# EasyEDA Pro project ESP32_wroom_C.eprj, board PCB1
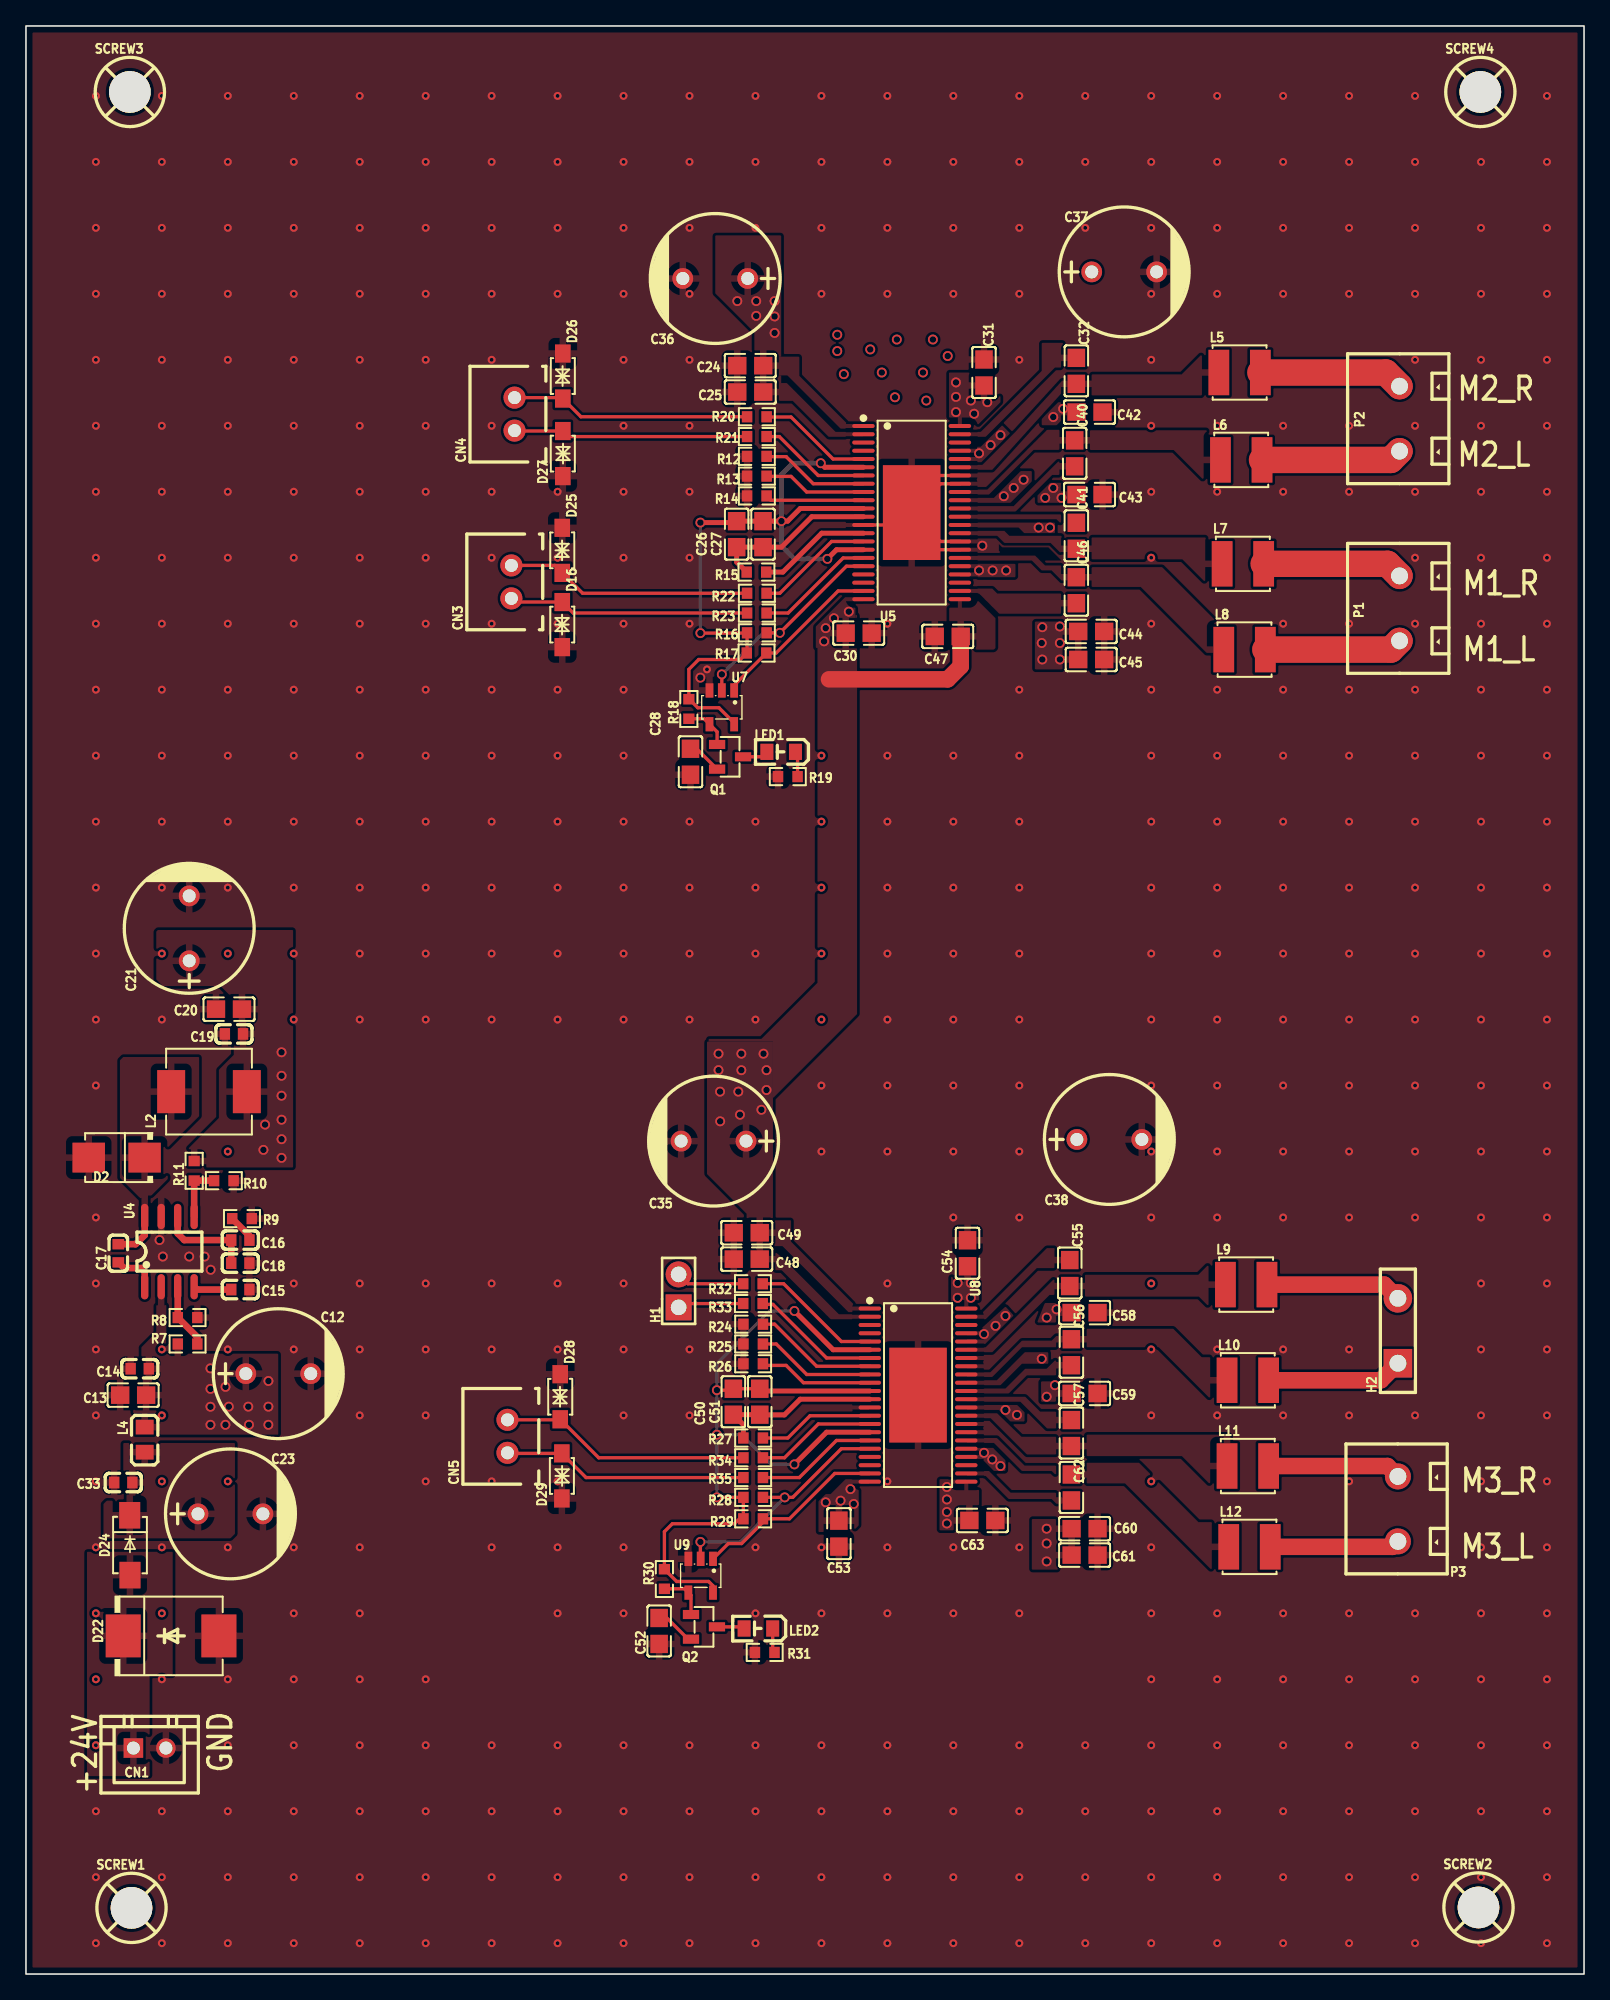
[diagram p1: board, top side]
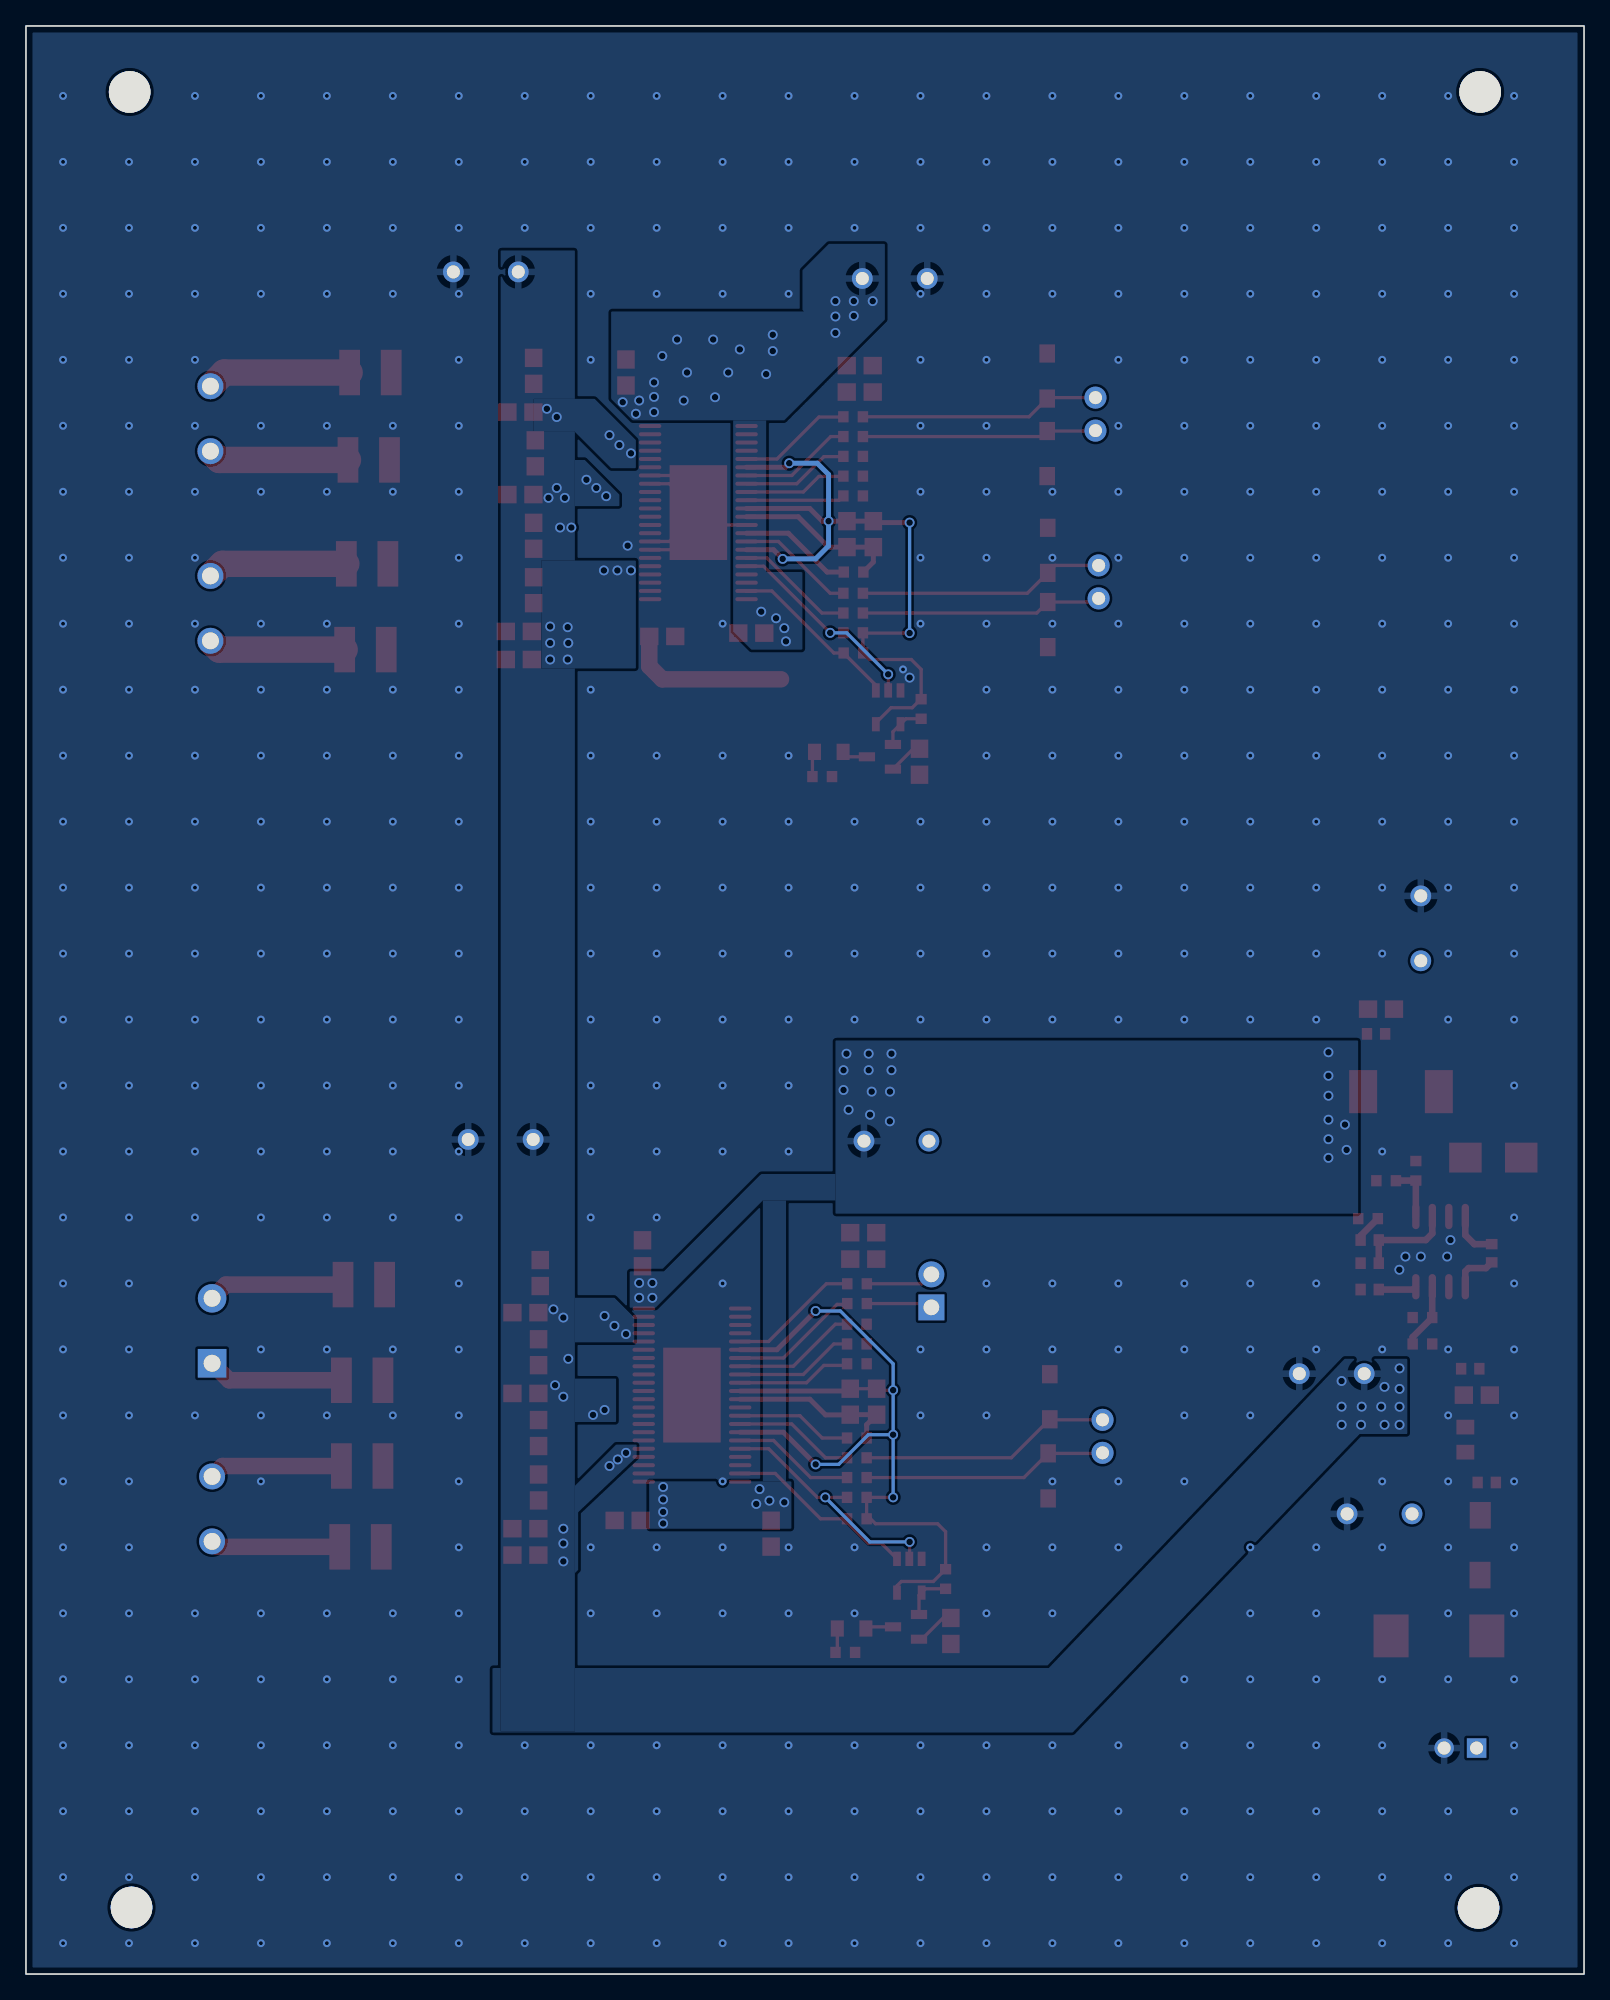
[diagram p2: board, bottom side, seen from below]

Outline 120 x 150 mm; copper layers: Top Layer, Bottom Layer. Coordinates in mm from the lower left corner of the outline.
Outline path: rectangle 0,150 120,0
Stack: Top Layer 0.035mm / Dielectric1 1.51mm FR4 er 4.5 / Bottom Layer 0.035mm

## Design rules (mm)
template: 自定义配置
spacing copperThickness1oz (default): track to track 0.102, other pairs 0.152 to 0.3
spacing copperThickness2oz: track to track 0.203, other pairs 0.152 to 0.508
track width copperThickness1oz (default): min 0.127, default 0.254, max 2.54
track width copperThickness2oz: min 0.203, default 0.254, max 2.54
differential pair differentialPair (default): width min 0.127, default 0.254, max 2.54; gap min 0.152, default 0.152
via viaSize (default): diameter min 0.5, default 0.61, max 10; hole min 0.3, default 0.305, max 6.299

## Placement (name value [footprint] x y rotation side)
C12  470uF  [CAP-TH_BD10.0-P5.00-D0.6-FD-A]  19.43 46.23 0 top
C13  10uF  [C0805]  8.25 44.58 0 top
C14  100nF  [C0603]  8.76 46.61 0 top
C15  10nF  [C0603]  16.51 52.71 180 top
C16  1nF  [C0603]  16.51 56.52 180 top
C17  100nF  [C0603]  7.11 55.5 90 top
C18  100pF  [C0603]  16.51 54.74 180 top
C19  100nF  [C0603]  16.02 72.39 0 top
C20  10uF  [C0805]  15.64 74.29 0 top
C21  470uF  [CAP-TH_BD10.0-P5.00-D0.6-FD-A]  12.57 80.52 90 top
C23  470uF  [CAP-TH_BD10.0-P5.00-D0.6-FD-A]  15.75 35.43 0 top
C24  1uF  [C0805]  55.78 123.85 180 top
C25  1uF  [C0805]  55.78 121.81 180 top
C26  1uF  [C0805]  54.74 110.87 90 top
C27  100nF  [C0805]  56.77 110.87 90 top
C28  100nF  [C0805]  51.18 93.34 270 top
C30  1uF  [C0805]  64.13 103.25 180 top
C31  1uF  [C0805]  73.79 123.32 90 top
C32  100nF  [C0805]  80.9 123.44 90 top
C33  100nF  [C0603]  7.49 37.85 0 top
C35  470uF /50V  [CAP-TH_BD10.0-P5.00-D0.6-FD-A]  52.96 64.14 180 top
C36  470uF /50V  [CAP-TH_BD10.0-P5.00-D0.6-FD-A]  53.09 130.56 180 top
C37  470uF /50V  [CAP-TH_BD10.0-P5.00-D0.6-FD-A]  84.58 131.06 0 top
C38  470uF /50V  [CAP-TH_BD10.0-P5.00-D0.6-FD-A]  83.44 64.26 0 top
C40  100nF  [C0805]  80.77 117.09 270 top
C41  100nF  [C0805]  80.9 110.74 90 top
C42  100nF  [C0805]  81.91 120.27 180 top
C43  100nF  [C0805]  81.91 113.92 180 top
C44  100nF  [C0805]  82.04 103.38 0 top
C45  100nF  [C0805]  82.04 101.22 0 top
C46  100nF  [C0805]  80.9 106.55 270 top
C47  1uF  [C0805]  70.99 103 180 top
C48  1uF  [C0805]  55.51 55.05 180 top
C49  1uF  [C0805]  55.51 57.08 180 top
C50  1uF  [C0805]  54.48 44.07 90 top
C51  100nF  [C0805]  56.52 44.07 90 top
C52  100nF  [C0805]  48.77 26.42 270 top
C53  1uF  [C0805]  62.61 33.91 90 top
C54  1uF  [C0805]  72.52 55.5 90 top
C55  100nF  [C0805]  80.39 53.97 90 top
C56  100nF  [C0805]  80.52 47.88 270 top
C57  100nF  [C0805]  80.52 41.66 90 top
C58  100nF  [C0805]  81.53 50.93 180 top
C59  100nF  [C0805]  81.53 44.7 180 top
C60  100nF  [C0805]  81.53 34.29 0 top
C61  100nF  [C0805]  81.53 32.26 0 top
C62  100nF  [C0805]  80.52 37.47 270 top
C63  1uF  [C0805]  73.66 34.93 0 top
CN1  HX-XH2.54-2PZZ  [CONN-TH_2P-P2.50_HX-2.54MM-2P-ZZ-MS]  9.53 17.4 0 top
CN3  B2B-XH-A(LF)(SN)  [CONN-TH_B2B-XH-A-LF-SN]  37.38 107.19 90 top
CN4  B2B-XH-A(LF)(SN)  [CONN-TH_B2B-XH-A-LF-SN]  37.63 120.11 90 top
CN5  B2B-XH-A(LF)(SN)  [CONN-TH_B2B-XH-A-LF-SN]  37.08 41.4 90 top
D2  SS1060B  [SMB_L4.3-W3.6-LS5.3-RD]  6.98 62.87 180 top
D16  SMF24CA  [SOD-123FL_L2.7-W1.8-LS3.8-BI]  41.31 103.91 270 top
D22  SMCJ24A  [SMC_L6.9-W5.9-LS7.9-RD]  11.18 26.03 0 top
D24  SS54  [SMA_L4.3-W2.6-LS5.0-FD]  8 33.02 90 top
D25  SMF24CA  [SOD-123FL_L2.7-W1.8-LS3.8-BI]  41.31 109.62 270 top
D26  SMF24CA  [SOD-123FL_L2.7-W1.8-LS3.8-BI]  41.35 123.04 270 top
D27  SMF24CA  [SOD-123FL_L2.7-W1.8-LS3.8-BI]  41.35 117.08 90 top
D28  SMF24CA  [SOD-123FL_L2.7-W1.8-LS3.8-BI]  41.15 44.45 270 top
D29  SMF24CA  [SOD-123FL_L2.7-W1.8-LS3.8-BI]  41.28 38.35 90 top
H1  PZ254V-11-02P  [HDR-TH_2P-P2.54-V-M]  50.27 52.6 90 top
H2  971-SLR-THR-1.3/02  [HDR-TH_2P-P5.00-V-M]  105.66 49.53 90 top
L2  10uH  [IND-SMD_L7.1-W6.6]  14.1 67.95 0 top
L4  GZ2012D101TF  [L0805]  9.14 41.15 90 top
L5  4.7uH  [IND-SMD_L4.0-W4.0]  93.47 123.32 0 top
L6  4.7uH  [IND-SMD_L4.0-W4.0]  93.6 116.59 0 top
L7  4.7uH  [IND-SMD_L4.0-W4.0]  93.73 108.59 0 top
L8  4.7uH  [IND-SMD_L4.0-W4.0]  93.85 101.98 0 top
L9  4.7uH  [IND-SMD_L4.0-W4.0]  93.98 53.09 0 top
L10  4.7uH  [IND-SMD_L4.0-W4.0]  94.11 45.72 0 top
L11  4.7uH  [IND-SMD_L4.0-W4.0]  94.11 39.12 0 top
L12  4.7uH  [IND-SMD_L4.0-W4.0]  94.23 32.89 0 top
LED1  XL-2012SURC  [LED0805-RD_RED]  58.17 94.11 180 top
LED2  XL-2012SURC  [LED0805-RD_RED]  56.41 26.61 180 top
P1  WJ126V-5.0-2P  [CONN-TH_WJ126V-5.0-2P]  105.79 105.16 180 top
P2  WJ126V-5.0-2P  [CONN-TH_WJ126V-5.0-2P]  105.79 119.76 180 top
P3  WJ126V-5.0-2P  [CONN-TH_WJ126V-5.0-2P]  105.66 35.81 180 top
Q1  SI2305CDS-T1-GE3  [SOT-23-3_L2.9-W1.3-P1.90-LS2.4-BR]  54.23 93.73 180 top
Q2  SI2305CDS-T1-GE3  [SOT-23-3_L2.9-W1.3-P1.90-LS2.4-BR]  52.22 26.73 180 top
R7  12kΩ  [R0603]  12.45 48.51 180 top
R8  2.7kΩ  [R0603]  12.45 50.55 180 top
R9  22kΩ  [R0603]  16.64 58.17 180 top
R10  2kΩ  [R0603]  15.24 61.09 180 top
R11  27kΩ  [R0603]  12.95 61.85 90 top
R12  10kΩ  [R0603]  56.29 116.86 180 top
R13  10kΩ  [R0603]  56.29 115.34 180 top
R14  10kΩ  [R0603]  56.29 113.81 180 top
R15  82kΩ  [R0603]  56.26 107.95 180 top
R16  4.7kΩ  [R0603]  56.29 103.27 180 top
R17  4.7kΩ  [R0603]  56.27 101.72 180 top
R18  4.7kΩ  [R0603]  51.05 97.41 90 top
R19  1kΩ  [R0603]  58.67 92.2 0 top
R20  22Ω  [R0603]  56.29 119.91 180 top
R21  22Ω  [R0603]  56.29 118.39 180 top
R22  22Ω  [R0603]  56.29 106.32 180 top
R23  22Ω  [R0603]  56.29 104.8 180 top
R24  10kΩ  [R0603]  56.01 50.04 180 top
R25  10kΩ  [R0603]  56.01 48.51 180 top
R26  10kΩ  [R0603]  56.01 46.99 180 top
R27  82kΩ  [R0603]  56.01 41.28 180 top
R28  4.7kΩ  [R0603]  56.01 36.7 180 top
R29  4.7kΩ  [R0603]  56.01 35.05 180 top
R30  4.7kΩ  [R0603]  49.17 30.42 90 top
R31  1kΩ  [R0603]  56.9 24.77 0 top
R32  22Ω  [R0603]  55.99 53.15 180 top
R33  22Ω  [R0603]  55.99 51.63 180 top
R34  22Ω  [R0603]  56.01 39.75 180 top
R35  22Ω  [R0603]  56.01 38.23 180 top
SCREW1  -  [M3螺丝]  8.13 5.09 0 top
SCREW2  -  [M3螺丝]  111.87 5.12 0 top
SCREW3  -  [M3螺丝]  8 144.92 0 top
SCREW4  -  [M3螺丝]  112.01 144.92 0 top
U4  TPS54331DR  [SOIC-8_L5.0-W4.0-P1.27-LS6.0-BL]  11.05 55.63 0 top
U5  DRV8412DDWR  [HTSSOP-44_L14.0-W6.1-P0.64-LS8.1-BL-EP]  68.22 112.53 270 top
U7  SN74AHC1G08DBVR  [SOT-23-5_L3.0-W1.7-P0.95-LS2.8-BR]  53.59 97.54 90 top
U8  DRV8412DDWR  [HTSSOP-44_L14.0-W6.1-P0.64-LS8.1-BL-EP]  68.71 44.58 270 top
U9  SN74AHC1G08DBVR  [SOT-23-5_L3.0-W1.7-P0.95-LS2.8-BR]  51.97 30.67 90 top

## Footprints (pads in the part's own frame, mm; a bottom-side part is the same pattern mirrored in y, then rotated)
C0603
  rect 0.8x0.9 smd: 1(-0.7,0) 2(0.7,0)
C0805
  rect 1.41x1.35 smd: 1(-1,0) 2(1,0)
CAP-TH_BD10.0-P5.00-D0.6-FD-A
  round 1.6 hole 1: 1(-2.5,0) 2(2.5,0)
CONN-TH_2P-P2.50_HX-2.54MM-2P-ZZ-MS
  rect 1.5x1.5 hole 1: 1(-1.25,0)
  round 1.5 hole 1: 2(1.25,0)
CONN-TH_B2B-XH-A-LF-SN
  round 1.7 hole 1: 1(1.27,0) 2(-1.27,0)
CONN-TH_WJ126V-5.0-2P
  round 2 hole 1.3: 1(0,2.501) 2(0,-2.501)
HDR-TH_2P-P2.54-V-M
  rect 2x2 hole 1.2: 1(-1.27,0)
  round 2 hole 1.2: 2(1.27,0)
HDR-TH_2P-P5.00-V-M
  rect 2.2x2.2 hole 1.3: 1(-2.5,0)
  round 2.2 hole 1.3: 2(2.5,0)
HTSSOP-44_L14.0-W6.1-P0.64-LS8.1-BL-EP
  oval 0.308x1.729 smd: 1(-6.668,-3.715) 2(-6.032,-3.715) 3(-5.397,-3.715) 4(-4.763,-3.715) 5(-4.128,-3.715) 6(-3.493,-3.715) 7(-2.857,-3.715) 8(-2.223,-3.715) 9(-1.587,-3.715) 10(-0.953,-3.715) 11(-0.318,-3.715) 12(0.318,-3.715) 13(0.953,-3.715) 14(1.587,-3.715) 15(2.223,-3.715) 16(2.857,-3.715) 17(3.493,-3.715) 18(4.128,-3.715) 19(4.763,-3.715) 20(5.397,-3.715) 21(6.032,-3.715) 22(6.668,-3.715) 23(6.668,3.715) 24(6.032,3.715) 25(5.397,3.715) 26(4.763,3.715) 27(4.128,3.715) 28(3.493,3.715) 29(2.857,3.715) 30(2.223,3.715) 31(1.587,3.715) 32(0.953,3.715) 33(0.318,3.715) 34(-0.318,3.715) 35(-0.953,3.715) 36(-1.587,3.715) 37(-2.223,3.715) 38(-2.857,3.715) 39(-3.493,3.715) 40(-4.128,3.715) 41(-4.763,3.715) 42(-5.397,3.715) 43(-6.032,3.715) 44(-6.668,3.715)
  rect 7.3x4.43 smd: 45(0,0)
IND-SMD_L4.0-W4.0
  rect 1.6x3.5 smd: 1(-1.6,0) 2(1.6,0)
IND-SMD_L7.1-W6.6
  rect 2.15x3.32 smd: 1(-2.913,0) 2(2.913,0)
L0805
  rect 1.133x1.377 smd: 1(-0.966,0) 2(0.966,0)
LED0805-RD_RED
  rect 1x1.25 smd: 1(-1.1,0) 2(1.1,0)
M3螺丝
  round 3.2 hole 3.2: 1(0,0)
R0603
  rect 0.806x0.864 smd: 1(-0.753,0) 2(0.753,0)
SMA_L4.3-W2.6-LS5.0-FD
  rect 2.046x1.62 smd: 1(-2.304,-0.009) 2(2.304,0.009)
SMB_L4.3-W3.6-LS5.3-RD
  rect 2.5x2.3 smd: 1(-2.15,0) 2(2.15,0)
SMC_L6.9-W5.9-LS7.9-RD
  rect 2.7x3.3 smd: 1(-3.687,0) 2(3.687,0)
SOD-123FL_L2.7-W1.8-LS3.8-BI
  rect 1.4x1.2 smd: 1(-1.735,0) 2(1.735,0)
SOIC-8_L5.0-W4.0-P1.27-LS6.0-BL
  oval 0.569x1.95 smd: 1(-1.905,-2.705) 2(-0.635,-2.705) 3(0.635,-2.705) 4(1.905,-2.705) 5(1.905,2.705) 6(0.635,2.705) 7(-0.635,2.705) 8(-1.905,2.705)
SOT-23-3_L2.9-W1.3-P1.90-LS2.4-BR
  rect 1.25x0.7 smd: 1(1,-0.95) 2(1,0.95) 3(-1,0)
SOT-23-5_L3.0-W1.7-P0.95-LS2.8-BR
  rect 1.1x0.6 smd: 1(1.3,-0.95) 2(1.3,0) 3(1.3,0.95) 4(-1.3,0.95) 5(-1.3,-0.95)

## Nets
As in the schematic.

Pads without a net: SCREW1 1; SCREW2 1; SCREW3 1; SCREW4 1; U5 3 4 19 20 25 42; U8 3 4 19 20 25 42

## Via types
v1: diameter 0.762, hole 0.508, Top Layer to Bottom Layer, 130 vias
v2: diameter 0.61, hole 0.305, Top Layer to Bottom Layer, 515 vias

## Routing (per net, layer and track width the routed paths; a pad name or vN(x,y) marks a point on that pad's centre or on a via; arc(x,y) is an arc through that point)
+12V: length 12.9
  Top Layer w1.27: 61.85,99.7 70.99,99.7 71.99,100.7 C47.1
  vias: v1(18.29,63.46) v1(18.42,65.41) v1(19.69,70.98) v1(19.69,69.17) v1(19.69,67.63) v1(19.69,65.78) v1(19.69,64.28) v1(19.69,62.84) v1(53.34,70.87) v1(53.34,69.6) v1(53.46,67.95) v1(53.47,65.66) v1(54.79,128.82) v1(54.86,67.95) v1(54.99,66.17) v1(55.1,70.87) v1(55.1,69.6) v1(56.24,128.82) v1(56.24,127.68) v1(56.64,66.55) v1(56.81,70.87) v1(57.03,69.6) v1(57.03,68.07) v1(57.66,128.82) v1(57.66,127.63) v1(57.66,126.37) v1(61.47,102.62) v1(61.59,103.63) v1(61.59,36.32) v1(62.23,104.39) v1(62.48,126.22) v1(62.48,124.97) v1(62.74,36.45) v1(62.99,123.19) v1(63.37,104.9) v1(63.5,37.34) v1(63.75,36.19) v1(65.02,125.09) v1(65.91,123.32) v1(66.93,121.41) v1(67.07,125.86) v1(69.09,123.32) v1(69.34,121.16) v1(69.85,125.86) v1(70.93,37.5) v1(70.93,36.54) v1(70.93,35.58) v1(70.93,34.69) v1(70.99,124.59) v1(71.63,122.56) v1(71.63,121.44) v1(71.63,120.27) v1(71.75,53.21) v1(71.75,52.07) v1(72.77,121.16) v1(72.77,53.21) v1(72.77,52.07) v1(73.03,120.14) v1(74.04,121.03)
AGND_C1: length 13
  Top Layer w0.381: U5.12 60.52,112.21 58.18,109.87 C27.1 C26.1 54.74,108.72 R15.2
AGND_C2: length 13.1
  Top Layer w0.381: R27.2 55.25,42.3 C50.1 C51.1 56.53,43.05 58.42,43.05 59.63,44.26 U8.12
GND: length 23.8
  Top Layer w0.254: 70.44,110.31 69.41,110.31 68.78,109.67 U5.29 ; 70.44,110.31 U5.30 ; 70.44,110.31 U5.45 ; U5.13 67.26,111.58 U5.45 ; U5.37 70.44,114.75 ; 70.44,114.75 69.27,114.75 68.64,115.39 U5.38 ; 70.44,114.75 U5.45
  vias: v1(10.29,56.52) v1(10.54,55.25) v1(12.57,55.25) v1(13.76,55.25) v1(14.22,54.23) v1(51.94,99.82) v1(73.66,109.98) v2(5.39,144.62) v2(5.39,139.53) v2(5.39,134.46) v2(5.39,129.38) v2(5.39,124.3) v2(5.39,119.22) v2(5.39,114.14) v2(5.39,109.06) v2(5.39,103.98) v2(5.39,98.9) v2(5.39,93.81) v2(5.39,88.73) v2(5.39,83.66) v2(5.39,78.58) v2(5.39,73.5) v2(5.39,68.42) v2(5.39,58.26) v2(5.39,53.18) v2(5.39,48.09) v2(5.39,43.02) v2(5.39,37.94) v2(5.39,32.86) v2(5.39,27.78) v2(5.39,22.69) v2(5.39,17.62) v2(5.39,12.53) v2(5.39,7.46) v2(5.39,2.38) v2(10.47,144.62) v2(10.47,139.53) v2(10.47,134.46) v2(10.47,129.38) v2(10.47,124.3) v2(10.47,119.22) v2(10.47,114.14) v2(10.47,109.06) v2(10.47,103.98) v2(10.47,98.9) v2(10.47,93.81) v2(10.47,88.73) v2(10.47,83.66) v2(10.47,78.58) v2(10.47,73.5) v2(10.47,48.09) v2(10.47,43.02) v2(10.47,37.94) v2(10.47,32.86) v2(10.47,27.78) v2(10.47,22.69) v2(10.47,12.53) v2(10.47,7.46) v2(10.47,2.38) v2(15.55,144.62) v2(15.55,139.53) v2(15.55,134.46) v2(15.55,129.38) v2(15.55,124.3) v2(15.55,119.22) v2(15.55,114.14) v2(15.55,109.06) v2(15.55,103.98) v2(15.55,98.9) v2(15.55,93.81) v2(15.55,88.73) v2(15.55,83.66) v2(15.55,78.58) v2(15.55,63.34) v2(15.55,48.09) v2(15.55,37.94) v2(15.55,32.86) v2(15.55,22.69) v2(15.55,17.62) v2(15.55,12.53) v2(15.55,7.46) v2(15.55,2.38) v2(20.62,144.62) v2(20.62,139.53) v2(20.62,134.46) v2(20.62,129.38) v2(20.62,124.3) v2(20.62,119.22) v2(20.62,114.14) v2(20.62,109.06) v2(20.62,103.98) v2(20.62,98.9) v2(20.62,93.81) v2(20.62,88.73) v2(20.62,83.66) v2(20.62,78.58) v2(20.62,73.5) v2(20.62,53.18) v2(20.62,48.09) v2(20.62,32.86) v2(20.62,27.78) v2(20.62,22.69) v2(20.62,17.62) v2(20.62,12.53) v2(20.62,7.46) v2(20.62,2.38) v2(25.7,144.62) v2(25.7,139.53) v2(25.7,134.46) v2(25.7,129.38) v2(25.7,124.3) v2(25.7,119.22) v2(25.7,114.14) v2(25.7,109.06) v2(25.7,103.98) v2(25.7,98.9) v2(25.7,93.81) v2(25.7,88.73) v2(25.7,83.66) v2(25.7,78.58) v2(25.7,73.5) v2(25.7,53.18) v2(25.7,48.09) v2(25.7,43.02) v2(25.7,32.86) v2(25.7,27.78) v2(25.7,22.69) v2(25.7,17.62) v2(25.7,12.53) v2(25.7,7.46) v2(25.7,2.38) v2(30.78,144.62) v2(30.78,139.53) v2(30.78,134.46) v2(30.78,129.38) v2(30.78,124.3) v2(30.78,119.22) v2(30.78,114.14) v2(30.78,109.06) v2(30.78,103.98) v2(30.78,98.9) v2(30.78,93.81) v2(30.78,88.73) v2(30.78,83.66) v2(30.78,78.58) v2(30.78,73.5) v2(30.78,53.18) v2(30.78,48.09) v2(30.78,43.02) v2(30.78,37.94) v2(30.78,22.69) v2(30.78,17.62) v2(30.78,12.53) v2(30.78,7.46) v2(30.78,2.38) v2(35.86,144.62) v2(35.86,139.53) v2(35.86,134.46) v2(35.86,129.38) v2(35.86,124.3) v2(35.86,119.22) v2(35.86,114.14) v2(35.86,109.06) v2(35.86,103.98) v2(35.86,98.9) v2(35.86,93.81) v2(35.86,88.73) v2(35.86,83.66) v2(35.86,78.58) v2(35.86,73.5) v2(35.86,53.18) v2(35.86,48.09) v2(35.86,37.94) v2(35.86,32.86) v2(35.86,17.62) v2(35.86,12.53) v2(35.86,7.46) v2(35.86,2.38) v2(40.95,144.62) v2(40.95,139.53) v2(40.95,134.46) v2(40.95,129.38) v2(40.95,114.14) v2(40.95,109.06) v2(40.95,103.98) v2(40.95,98.9) v2(40.95,93.81) v2(40.95,88.73) v2(40.95,83.66) v2(40.95,78.58) v2(40.95,73.5) v2(40.95,53.18) v2(40.95,48.09) v2(40.95,37.94) v2(40.95,32.86) v2(40.95,27.78) v2(40.95,17.62) v2(40.95,12.53) v2(40.95,7.46) v2(40.95,2.38) v2(46.03,144.62) v2(46.03,139.53) v2(46.03,134.46) v2(46.03,129.38) v2(46.03,124.3) v2(46.03,119.22) v2(46.03,114.14) v2(46.03,109.06) v2(46.03,103.98) v2(46.03,98.9) v2(46.03,93.81) v2(46.03,88.73) v2(46.03,83.66) v2(46.03,78.58) v2(46.03,73.5) v2(46.03,53.18) v2(46.03,48.09) v2(46.03,43.02) v2(46.03,32.86) v2(46.03,27.78) v2(46.03,17.62) v2(46.03,12.53) v2(46.03,7.46) v2(46.03,2.38) v2(51.1,144.62) v2(51.1,139.53) v2(51.1,134.46) v2(51.1,129.38) v2(51.1,124.3) v2(51.1,119.22) v2(51.1,114.14) v2(51.1,109.06) v2(51.1,103.98) v2(51.1,88.73) v2(51.1,83.66) v2(51.1,78.58) v2(51.1,73.5) v2(51.1,48.09) v2(51.1,43.02) v2(51.1,17.62) v2(51.1,12.53) v2(51.1,7.46) v2(51.1,2.38) v2(52.45,100.46) v2(56.19,144.62) v2(56.19,139.53) v2(56.19,134.46) v2(56.19,88.73) v2(56.19,83.66) v2(56.19,78.58) v2(56.19,73.5) v2(56.19,32.86) v2(56.19,27.78) v2(56.19,17.62) v2(56.19,12.53) v2(56.19,7.46) v2(56.19,2.38) v2(61.27,144.62) v2(61.27,139.53) v2(61.27,134.46) v2(61.27,129.38) v2(61.27,93.81) v2(61.27,88.73) v2(61.27,83.66) v2(61.27,78.58) v2(61.27,73.5) v2(61.27,68.42) v2(61.27,63.34) v2(61.27,32.86) v2(61.27,27.78) v2(61.27,17.62) v2(61.27,12.53) v2(61.27,7.46) v2(61.27,2.38) v2(66.34,144.62) v2(66.34,139.53) v2(66.34,134.46) v2(66.34,129.38) v2(66.34,103.98) v2(66.34,93.81) v2(66.34,88.73) v2(66.34,83.66) v2(66.34,78.58) v2(66.34,73.5) v2(66.34,68.42) v2(66.34,63.34) v2(66.34,53.18) v2(66.34,37.94) v2(66.34,32.86) v2(66.34,27.78) v2(66.34,17.62) v2(66.34,12.53) v2(66.34,7.46) v2(66.34,2.38) v2(71.43,144.62) v2(71.43,139.53) v2(71.43,134.46) v2(71.43,129.38) v2(71.43,93.81) v2(71.43,88.73) v2(71.43,83.66) v2(71.43,78.58) v2(71.43,73.5) v2(71.43,68.42) v2(71.43,63.34) v2(71.43,58.26) v2(71.43,32.86) v2(71.43,27.78) v2(71.43,17.62) v2(71.43,12.53) v2(71.43,7.46) v2(71.43,2.38) v2(76.5,144.62) v2(76.5,139.53) v2(76.5,134.46) v2(76.5,129.38) v2(76.5,124.3) v2(76.5,98.9) v2(76.5,93.81) v2(76.5,88.73) v2(76.5,83.66) v2(76.5,78.58) v2(76.5,73.5) v2(76.5,68.42) v2(76.5,63.34) v2(76.5,58.26) v2(76.5,32.86) v2(76.5,27.78) v2(76.5,17.62) v2(76.5,12.53) v2(76.5,7.46) v2(76.5,2.38) v2(81.59,144.62) v2(81.59,139.53) v2(81.59,134.46) v2(81.59,17.62) v2(81.59,12.53) v2(81.59,7.46) v2(81.59,2.38) v2(86.66,144.62) v2(86.66,139.53) v2(86.66,134.46) v2(86.66,129.38) v2(86.66,124.3) v2(86.66,119.22) v2(86.66,114.14) v2(86.66,109.06) v2(86.66,103.98) v2(86.66,98.9) v2(86.66,93.81) v2(86.66,88.73) v2(86.66,83.66) v2(86.66,78.58) v2(86.66,73.5) v2(86.66,68.42) v2(86.66,63.34) v2(86.66,58.26) v2(86.66,53.18) v2(86.66,48.09) v2(86.66,43.02) v2(86.66,37.94) v2(86.66,32.86) v2(86.66,27.78) v2(86.66,22.69) v2(86.66,17.62) v2(86.66,12.53) v2(86.66,7.46) v2(86.66,2.38) v2(91.75,144.62) v2(91.75,139.53) v2(91.75,134.46) v2(91.75,129.38) v2(91.75,119.22) v2(91.75,114.14) v2(91.75,98.9) v2(91.75,93.81) v2(91.75,88.73) v2(91.75,83.66) v2(91.75,78.58) v2(91.75,73.5) v2(91.75,68.42) v2(91.75,63.34) v2(91.75,58.26) v2(91.75,48.09) v2(91.75,43.02) v2(91.75,27.78) v2(91.75,22.69) v2(91.75,17.62) v2(91.75,12.53) v2(91.75,7.46) v2(91.75,2.38) v2(96.82,144.62) v2(96.82,139.53) v2(96.82,134.46) v2(96.82,129.38) v2(96.82,119.22) v2(96.82,114.14) v2(96.82,103.98) v2(96.82,98.9) v2(96.82,93.81) v2(96.82,88.73) v2(96.82,83.66) v2(96.82,78.58) v2(96.82,73.5) v2(96.82,68.42) v2(96.82,63.34) v2(96.82,58.26) v2(96.82,48.09) v2(96.82,43.02) v2(96.82,27.78) v2(96.82,22.69) v2(96.82,17.62) v2(96.82,12.53) v2(96.82,7.46) v2(96.82,2.38) v2(101.91,144.62) v2(101.91,139.53) v2(101.91,134.46) v2(101.91,129.38) v2(101.91,119.22) v2(101.91,114.14) v2(101.91,103.98) v2(101.91,98.9) v2(101.91,93.81) v2(101.91,88.73) v2(101.91,83.66) v2(101.91,78.58) v2(101.91,73.5) v2(101.91,68.42) v2(101.91,63.34) v2(101.91,58.26) v2(101.91,48.09) v2(101.91,43.02) v2(101.91,37.94) v2(101.91,27.78) v2(101.91,22.69) v2(101.91,17.62) v2(101.91,12.53) v2(101.91,7.46) v2(101.91,2.38) v2(106.99,144.62) v2(106.99,139.53) v2(106.99,134.46) v2(106.99,129.38) v2(106.99,124.3) v2(106.99,119.22) v2(106.99,114.14) v2(106.99,109.06) v2(106.99,103.98) v2(106.99,98.9) v2(106.99,93.81) v2(106.99,88.73) v2(106.99,83.66) v2(106.99,78.58) v2(106.99,73.5) v2(106.99,68.42) v2(106.99,63.34) v2(106.99,58.26) v2(106.99,43.02) v2(106.99,27.78) v2(106.99,22.69) v2(106.99,17.62) v2(106.99,12.53) v2(106.99,7.46) v2(106.99,2.38) v2(112.06,139.53) v2(112.06,134.46) v2(112.06,129.38) v2(112.06,124.3) v2(112.06,119.22) v2(112.06,114.14) v2(112.06,109.06) v2(112.06,103.98) v2(112.06,98.9) v2(112.06,93.81) v2(112.06,88.73) v2(112.06,83.66) v2(112.06,78.58) v2(112.06,73.5) v2(112.06,68.42) v2(112.06,63.34) v2(112.06,58.26) v2(112.06,53.18) v2(112.06,48.09) v2(112.06,43.02) v2(112.06,37.94) v2(112.06,32.86) v2(112.06,27.78) v2(112.06,22.69) v2(112.06,17.62) v2(112.06,12.53) v2(112.06,7.46) v2(112.06,2.38) v2(117.15,144.62) v2(117.15,139.53) v2(117.15,134.46) v2(117.15,129.38) v2(117.15,124.3) v2(117.15,119.22) v2(117.15,114.14) v2(117.15,109.06) v2(117.15,103.98) v2(117.15,98.9) v2(117.15,93.81) v2(117.15,88.73) v2(117.15,83.66) v2(117.15,78.58) v2(117.15,73.5) v2(117.15,68.42) v2(117.15,63.34) v2(117.15,58.26) v2(117.15,53.18) v2(117.15,48.09) v2(117.15,43.02) v2(117.15,37.94) v2(117.15,32.86) v2(117.15,27.78) v2(117.15,22.69) v2(117.15,17.62) v2(117.15,12.53) v2(117.15,7.46) v2(117.15,2.38)
VCC_24V:
  vias: v1(14.21,46.64) v1(14.21,45.06) v1(14.21,43.68) v1(14.21,42.29) v1(15.37,45.21) v1(15.36,42.29) v1(15.62,43.69) v1(17.12,43.69) v1(17.17,42.29) v1(18.67,45.66) v1(18.67,43.69) v1(18.67,42.29) v1(73.41,117.09) v1(73.41,108.08) v1(73.79,49.28) v1(73.79,40.13) v1(74.29,117.73) v1(74.45,108.08) v1(74.42,39.62) v1(74.68,49.91) v1(75.06,118.49) v1(75.06,39.12) v1(75.31,113.79) v1(75.44,50.67) v1(75.44,43.43) v1(75.49,108.08) v1(76.07,114.43) v1(76.33,43.05) v1(76.84,115.06) v1(78,111.38) v1(78.23,102.49) v1(78.23,47.37) v1(78.28,103.7) v1(78.28,101.22) v1(78.5,113.67) v1(78.61,50.55) v1(78.61,44.45) v1(78.61,34.29) v1(78.61,33.15) v1(78.61,31.77) v1(78.87,111.38) v1(79.12,119.89) v1(79.12,114.43) v1(79.25,45.34) v1(79.38,51.18) v1(79.63,103.76) v1(79.63,102.49) v1(79.63,101.22) v1(79.76,113.67) v1(79.88,120.52)
M1_L: length 10.6
  Top Layer w2.032: P1.1 105.12,101.98 L8.2
M1_R: length 10.8
  Top Layer w2.032: P1.2 104.86,108.59 L7.2
M2_L: length 10.9
  Top Layer w2.032: 95.2,116.59 105.12,116.59 P2.1
M2_R: length 11.2
  Top Layer w2.032: L5.2 104.74,123.32 P2.2
M3_L: length 10
  Top Layer w1.27: P3.1 105.24,32.89 L12.2
M3_R: length 10.3
  Top Layer w1.27: L11.2 104.86,39.12 P3.2
M4_L: length 10.5
  Top Layer w1.27: H2.1 104.35,45.72 L10.2
M4_R: length 10.5
  Top Layer w1.27: H2.2 104.61,53.09 L9.2
PWM_M1_L: length 18.6
  Top Layer w0.254: R23.2 42.15,104.8 D16.1 37.67,105.64 CN3.2
PWM_M1_R: length 19
  Top Layer w0.254: R22.2 42.87,106.32 D25.2 40.73,108.46 CN3.1
PWM_M2_L: length 18.1
  Top Layer w0.254: CN4.2 37.66,118.81 D27.2 41.77,118.39 R21.2
PWM_M2_R: length 18.5
  Top Layer w0.254: R20.2 42.75,119.91 D26.2 41.27,121.38 CN4.1
PWM_M3_L: length 19
  Top Layer w0.254: R35.2 43.14,38.23 D29.2 37.13,40.09 CN5.2
PWM_M3_R: length 19.4
  Top Layer w0.254: 37.08,42.67 41.11,42.67 D28.2 44.11,39.75 R34.2
PWM_M4_L: length 5.1
  Top Layer w0.254: R33.2 50.56,51.63 H1.1
PWM_M4_R: length 5.3
  Top Layer w0.254: R32.2 50.99,53.15 H1.2
VREF_C1: length 57.6
  Top Layer w0.254: U7.5 54.54,96.33 53.37,97.51 51.74,97.51 51.08,98.16 R18.2 51.05,100.46 51.82,101.22 55.02,101.22 R17.2 55.54,101.74 R16.2 55.52,103.25 v1(51.94,103.25)
  Top Layer w0.381: v1(61.72,108.97) 62.43,109.67 U5.16 ; v1(51.94,111.76) 54.63,111.76 C26.2 C27.2 v1(58.19,111.87) 58.66,111.87 59.63,112.85 U5.11 ; U5.6 61.52,116.02 v1(61.21,116.33)
  Bottom Layer w0.254: v1(51.94,103.25) v1(51.94,111.76)
  Bottom Layer w0.381: v1(61.21,116.33) 59.06,116.33 58.19,115.46 v1(58.19,111.87) 58.19,109.96 59.18,108.97 v1(61.72,108.97)
VREF_C2: length 68.6
  Top Layer w0.254: C51.2 C50.2 54.37,44.96 v1(53.21,44.96) ; v1(53.21,36.7) R28.2 55.25,35.36 ; U9.5 52.92,29.89 52.58,30.23 50.12,30.23 R30.2 49.17,34.06 49.78,34.67 54.57,34.67 55.25,35.36 ; 55.25,35.36 R29.2
  Top Layer w0.381: v1(59.18,39.24) 61.66,41.72 U8.16 ; U8.11 56.69,44.89 C51.2 ; U8.6 62.17,48.07 v1(59.18,51.05)
  Bottom Layer w0.254: v1(59.18,39.24) 57.4,39.24 55.12,41.53 v1(53.21,41.53) ; v1(59.18,51.05) 57.28,51.05 53.21,46.99 v1(53.21,44.96) v1(53.21,41.53) ; v1(53.21,41.53) v1(53.21,36.7)
$1N1956: length 4.9
  Top Layer w0.508: 13.2,48.64 13.2,49.04 R8.2 11.69,52.91 U4.3
$1N1957: length 2.9
  Top Layer w0.508: C15.2 13.17,52.71 U4.4
$1N1958: length 3.5
  Top Layer w0.508: U4.1 9.14,54.1 8.89,54.36 7.56,54.36 C17.1
$1N1959: length 3.8
  Top Layer w0.508: U4.8 9.14,56.9 8.45,56.2 C17.2
$1N1961: length 2.2
  Top Layer w0.508: C16.1 17.21,56.84 R9.2
$1N1962: length 7.4
  Top Layer w0.508: U4.6 11.68,57.02 12.19,56.52 C16.2 C18.2
$1N1963: length 4.4
  Top Layer w0.508: U4.5 R11.1 14.35,61.1 14.49,60.96
$1N3477: length 8.3
  Top Layer w0.254: R12.1 57.07,116.84 58.55,116.84 60.63,114.75 U5.8
$1N3483: length 8
  Top Layer w0.254: U5.9 60.13,114.12 58.93,115.32 57.07,115.32 R13.1
$1N3486: length 7.6
  Top Layer w0.254: R14.1 57.38,113.48 U5.10
$1N3753: length 8.7
  Top Layer w0.381: R15.1 58.29,107.95 61.29,110.94 U5.14
$1N4158: length 16.6
  Top Layer w0.254: v1(53.59,100.08) U7.2 ; R16.1 v1(58.06,103.27) 63.19,108.4 U5.18
  Bottom Layer w0.254: v1(53.59,100.08) 56.79,103.27 v1(58.06,103.27)
$1N4251: length 3.6
  Top Layer w0.254: R18.1 52.22,96.66 U7.4 53.23,95.65 Q1.1
$1N4373: length 2.7
  Top Layer w0.254: Q1.2 51.66,94.34 C28.1
$1N4506: length 2
  Top Layer w0.254: LED1.1 59.43,93.95 R19.2
$1N4523: length 2
  Top Layer w0.254: LED1.2 56.69,93.73 Q1.3
$1N6164: length 8.8
  Top Layer w0.254: R20.1 57.07,119.89 58.93,119.89 62.16,116.66 U5.5
$1N6209: length 8.7
  Top Layer w0.254: U5.7 61.02,115.39 58.02,118.39 R21.1
$1N6262: length 9.1
  Top Layer w0.254: R22.1 58.06,106.32 62.05,110.31 U5.15
$1N6307: length 9.2
  Top Layer w0.254: R23.1 58.69,104.8 62.94,109.04 U5.17
$1N8050: length 9.6
  Top Layer w0.254: R24.1 57.66,50.04 60.9,46.8 U8.8
$1N8052: length 9.2
  Top Layer w0.254: U8.9 60.13,46.16 57.78,48.51 R25.1
$1N8054: length 8.8
  Top Layer w0.254: R26.1 56.89,46.86 58.55,46.86 59.88,45.53 U8.10
$1N8077: length 8.9
  Top Layer w0.254: R27.1 58.67,41.28 60.39,42.99 U8.14
$1N8087: length 19
  Top Layer w0.254: R28.1 v1(58.44,36.7) 59.06,36.7 62.8,40.45 U8.18 ; v1(51.94,33.27) 51.94,31.99 51.97,31.97
  Bottom Layer w0.254: v1(51.94,33.27) 55.01,33.27 v1(58.44,36.7)
$1N8092: length 15
  Top Layer w0.254: 52.92,31.97 54.09,33.15 55.12,33.15 56.76,34.79 R29.1 58.8,35.05 62.29,38.54 U8.21
$1N8102: length 3.7
  Top Layer w0.254: R30.1 50.72,29.66 U9.4 51.22,29.17 Q2.1
$1N8105: length 2.6
  Top Layer w0.254: 49.3,27.48 50.99,25.78 Q2.2
$1N8109: length 1.9
  Top Layer w0.254: LED2.1 57.51,24.9 R31.2
$1N8113: length 2.1
  Top Layer w0.254: 55.31,26.61 55.18,26.73 Q2.3
$1N8212: length 10.1
  Top Layer w0.254: R32.1 58.36,53.15 62.8,48.7 U8.5
$1N8217: length 10
  Top Layer w0.254: R33.1 56.81,51.56 57.53,51.56 61.66,47.43 U8.7
$1N8222: length 9.3
  Top Layer w0.254: U8.15 61.02,42.35 58.42,39.75 R34.1
$1N8227: length 9.4
  Top Layer w0.254: U8.17 62.42,41.08 59.56,38.23 R35.1
$1N8570: length 13.1
  Top Layer w0.254: 54.61,99.06 54.61,99.31 R17.1 57.78,101.72 62.56,106.5 U5.21

## Copper pours and planes (outline as drawn; the poured copper is in the pictures)
+12V on Top Layer: 73.03,119 75.06,121.03 75.06,123.32 71.09,123.32 71.09,119
+12V on Top Layer: 65.41,118.36 65.41,118.75 62.36,118.75 58.6,122.5 56.1,122.5 56.1,121.13 59.06,121.13 61.83,118.36
+12V on Top Layer: 12.06,62.1 20.57,62.1 20.57,80.39 10.16,80.39 10.03,80.26 10.03,76.58 10.54,76.07 14.99,76.07 15.62,75.44 15.62,73.57 16,73.19 16,70.77 14.86,69.63 14.86,65.92 12.06,63.12
+12V on Top Layer: 65.41,105.66 63.88,105.66 63.88,102.62 63.37,102.11 60.83,102.11 60.83,103.76 63.12,106.05 65.41,106.05
+12V on Top Layer: 65.41,119 62.74,119 58.64,123.09 56.1,123.09 56.01,123.19 56.01,124.54 59.56,124.54 59.56,123.06 63.25,119.38 65.41,119.38
+12V on Top Layer: 73.41,38.1 73.41,34.16 70.36,34.16 70.36,38.08 70.38,38.1
+12V on Top Layer: 71.25,51.05 73.41,51.05 73.41,55.25 71.25,55.25
+12V on Top Layer: 65.86,50.97 63.35,50.97 58.26,56.05 55.5,56.05 55.5,58.04 58.93,58.04 58.93,56.39 63.88,51.44 65.86,51.44
+12V on Top Layer: 73.03,106.05 74.67,104.4 74.67,102.1 74.55,101.98 71.11,101.98 71.11,106.05
+12V on Top Layer: 65.91,37.72 64.13,37.72 64.13,34.54 63.63,34.04 61.04,34.04 61.04,36.4 61.59,36.96 61.98,36.96 63.12,38.1 65.91,38.1
+12V on Top Layer: 52.58,67.48 57.58,67.48 64.01,73.91 64.01,104.65 61.72,104.65 60.96,103.89 60.96,76.33 56.64,72.01 52.58,72.01
+12V on Top Layer: 56.1,121.13 56.1,126.4 53.09,129.41 53.09,133.87 58.17,133.87 58.17,121.18 58.12,121.13
+12V on Top Layer: 57.53,71.79 52.45,71.79 52.45,61.59 55.5,58.55 55.5,54.18 57.53,54.18
+12V on Top Layer: 65.91,50.42 61.98,50.42 58.21,54.19 55.51,54.19 55.51,55.8 57.54,55.76 58.29,55.12 62.61,50.8 65.91,50.8
+12V on Bottom Layer: 73.5,51.31 71.5,51.31 63.25,59.56 54.61,59.56 54.48,59.69 54.48,61.59 63.37,61.59 70.87,54.1 73.5,54.1
+12V on Bottom Layer: 65.53,122.3 65.53,103.38 64.13,101.98 60.2,101.98 60.2,107.95 62.99,107.95 62.99,122.17 63.12,122.3
+12V on Bottom Layer: 61.05,37.93 72.01,37.93 72.01,34.33 71.97,34.29 61.05,34.29
+12V on Bottom Layer: 63.25,61.09 63.25,35.56 61.47,35.56 61.47,61.03
+12V on Bottom Layer: 73.28,119.63 61.59,119.63 53.85,127.38 53.85,133.22 58.17,133.22 60.2,131.19 60.2,128.14 60.07,128.02 74.93,128.02 74.93,121.28
+12V on Bottom Layer: 57.66,58.55 57.66,71.88 17.4,71.88 17.4,58.55
+24V on Top Layer: 9.53,15.24 9.53,22.99 11.3,22.99 11.3,32.51 4.7,32.51 4.7,15.24
GND on Top Layer: 0,150 120,150 120,0 0,0
GND on Bottom Layer: 0,150 120,150 120,0 0,0
VCC_24V on Top Layer: 71.63,39.62 73.66,39.62 74.55,38.74 75.44,38.74 75.44,39.56 74.55,40.45 74.55,40.51 71.6,40.51 71.6,39.65
VCC_24V on Top Layer: 81.28,50.18 81.28,51.67 78.47,51.67 77.88,50.16 81.27,50.16
VCC_24V on Top Layer: 81.66,113.28 77.91,113.28 77.91,113.85 78.88,114.82 81.64,114.82 81.66,114.8
VCC_24V on Top Layer: 81.28,44.07 78.18,44.07 78.18,45.64 81.13,45.64 81.28,45.49
VCC_24V on Top Layer: 81.66,119.63 81.66,121.03 79.5,121.03 78.23,119.76 78.23,119.26 78.45,119.25 79.38,119.25 79.76,119.63
VCC_24V on Top Layer: 71.12,113.28 75.82,113.28 77.47,114.94 77.47,115.73 76.61,115.73 74.55,113.67 71.09,113.67 71.09,113.31
VCC_24V on Top Layer: 71.12,111.38 76.45,111.38 76.96,110.87 79.25,110.87 79.25,111.76 71.09,111.76 71.09,111.41
VCC_24V on Top Layer: 81.79,100.46 77.7,100.46 77.7,104.14 81.79,104.14
VCC_24V on Top Layer: 71.63,43.43 74.93,43.43 75.82,42.55 76.91,42.55 76.91,43.25 76.35,43.81 71.62,43.81 71.62,43.44
VCC_24V on Top Layer: 71.68,45.34 75.06,45.34 76.71,46.99 78.74,46.99 78.74,47.88 76.93,47.88 74.77,45.72 71.68,45.72
VCC_24V on Top Layer: 70.99,108.59 76.21,108.59 76.21,107.56 70.99,107.56
VCC_24V on Top Layer: 77.47,35.04 81.13,35.04 81.13,31.13 77.47,31.13
VCC_24V on Top Layer: 8.25,41.53 19.43,41.53 19.43,47.77 12.32,47.77 12.32,49.15 10.81,49.15 10.81,53.83 10.8,53.85 10.03,53.85 10.03,49.4 8.89,48.26 8.89,45.93 8.25,45.29
VCC_24V on Top Layer: 75.18,119.25 73.53,117.6 70.99,117.6 70.99,116.33 73.54,116.33 75.82,118.61
VCC_24V on Top Layer: 71.5,48.51 73.89,48.51 76.09,50.69 75.44,51.4 73.52,49.66 71.5,49.66
VCC_24V on Bottom Layer: 74.29,113.03 81.3,113.03 81.3,116.58 76.96,116.58 74.29,113.92
VCC_24V on Bottom Layer: 72.97,40.77 74.55,40.77 80.12,35.19 81.53,35.19 81.53,30.86 81.41,30.73 77.85,30.73 77.47,31.12 77.47,35.56 72.97,39.81
VCC_24V on Bottom Layer: 73.03,108.84 80.3,108.84 80.3,100.53 73.03,100.53
VCC_24V on Bottom Layer: 77.72,132.72 83.44,132.72 83.44,18.67 77.72,18.67
VCC_24V on Bottom Layer: 74.55,45.85 80.12,45.85 80.12,42.51 74.55,42.51
VCC_24V on Bottom Layer: 73.03,118.11 76.2,121.28 80.88,121.28 80.89,121.27 80.89,118.8 77.78,118.8 74.93,115.95 73.03,115.95
VCC_24V on Bottom Layer: 73.15,48.64 78.74,48.64 80.14,50.04 80.14,52.07 74.68,52.07 73.15,50.55
VCC_24V on Bottom Layer: 18.44,47.37 13.61,47.37 13.61,41.58 17.28,41.58 39.39,18.6 84.07,18.6 84.07,23.56 41.23,23.56
C1_OUT_A on Top Layer: 71.12,108.84 77.47,108.84 78.23,108.08 78.99,108.08 80.26,106.81 81.91,106.81 81.91,108.33 81.79,108.46 78.49,108.46 77.72,109.22 71.12,109.22
C1_OUT_A on Top Layer: 85.85,106.81 91.44,101.22 91.44,100.09 93.34,100.09 93.34,104.14 91.69,104.14 87.5,108.33 80.14,108.33 80.01,108.33 80.01,106.81
C1_OUT_B on Top Layer: 80.15,108.93 89.06,108.93 91.3,106.7 93.07,106.7 93.07,110.62 80,110.62 80,109.08
C1_OUT_B on Top Layer: 71.12,110.74 74.8,110.74 75.35,110.19 78.91,110.19 80.14,108.97 81.66,108.97 81.66,110.74 75.74,110.74 75.35,111.12 71.12,111.12
C1_OUT_C on Top Layer: 80.01,117.35 88.39,117.35 91.04,114.7 93.06,114.7 93.06,118.87 80.14,118.87 80.02,118.91
C1_OUT_C on Top Layer: 70.99,113.92 74.17,113.92 77.61,117.36 81.55,117.36 81.55,118.91 78.65,118.91 74.04,114.3 70.99,114.3
C1_OUT_D on Top Layer: 70.99,115.82 74.42,115.82 79.7,121.67 81.53,121.67 81.53,123.21 80.27,123.2 76.22,118.76 73.66,116.2 70.99,116.2
C1_OUT_D on Top Layer: 80.27,123.17 89.01,123.17 91.06,125.22 92.98,125.22 92.98,121.55 80.26,121.55 80.26,123.06
C2_OUT_A on Top Layer: 79.74,37.78 84.65,37.78 91.43,31 93.56,31 93.56,34.76 93.6,34.8 90.3,34.8 85.72,39.37 79.74,39.37
C2_OUT_A on Top Layer: 71.63,41.28 74.78,41.28 76.91,39.15 81.26,39.15 81.26,37.86 79.87,37.86 79,38.74 76.71,38.74 74.55,40.89 71.63,40.89
C2_OUT_B on Top Layer: 79.88,39.88 89.03,39.88 91.81,37.1 93.4,37.1 93.4,40.77 92.64,41.53 79.88,41.53
C2_OUT_B on Top Layer: 71.63,42.8 74.29,42.8 77.09,40 81.14,40 81.14,41.37 76.67,41.37 74.79,43.18 71.63,43.18
C2_OUT_C on Top Layer: 79.76,49.69 88.36,49.69 90.55,47.5 93.35,47.5 93.35,43.97 91.54,43.97 87.25,48.26 79.76,48.26
C2_OUT_C on Top Layer: 71.63,45.97 74.42,45.97 76.71,48.26 81.21,48.26 81.42,48.47 81.42,49.69 79.92,49.69 78.99,48.77 76.71,48.77 74.28,46.34 71.63,46.34 71.63,46.33
C2_OUT_D on Top Layer: 71.63,47.88 74.42,47.88 78.83,52.29 81.12,52.29 81.12,53.56 81.15,53.59 79.25,53.59 73.91,48.26 71.63,48.26
C2_OUT_D on Top Layer: 79.72,52.16 90.33,52.16 91.3,51.2 93.21,51.2 93.21,54.99 91.44,54.99 90.3,53.85 79.72,53.85
$1N1959 on Top Layer: 9.4,59.94 9.65,59.94 10.92,61.21 10.92,63.64 13.34,66.06 13.34,70.61 7.49,70.61 7.24,70.36 7.24,61.3 8.72,59.82 8.76,59.82 8.76,57.28 9.4,57.28
$1N1974 on Top Layer: 15.75,33.55 5.97,33.55 5.97,36.19 6.22,36.45 6.89,36.45 7.49,37.05 7.49,40.89 16.09,40.89 16.09,33.9
$1N4719 on Top Layer: 71.08,118.36 73.91,118.36 79.25,123.7 81.93,123.7 81.93,125.6 81.91,125.6 78.23,125.6 78.23,123.44 73.53,118.75 71.08,118.75
$1N5477 on Top Layer: 71.11,112.61 76.22,112.61 79.03,115.43 81.63,115.43 81.63,116.84 79.88,116.84 76.07,113.03 71.11,113.03
$1N5516 on Top Layer: 71.37,112.4 81.93,112.4 81.93,110.96 80.43,110.96 79.38,112.01 71.37,112.01
$1N6029 on Top Layer: 71.12,106.3 73.41,106.3 74.96,104.74 81.8,104.74 81.8,106.15 81.66,106.3 74.8,106.3 74.42,106.68 71.05,106.68 71.05,106.37
$1N8127 on Top Layer: 71.63,50.42 73.91,50.42 77.85,54.36 81.27,54.36 81.29,54.38 81.29,55.89 78.63,55.89 73.53,50.8 71.61,50.8 71.61,50.44
$1N8152 on Top Layer: 75.69,44.7 77.09,46.1 81.41,46.1 81.41,47.67 79.67,47.67 78.61,46.61 76.96,46.61 75.44,45.09 71.6,45.09 71.6,44.7
$1N8157 on Top Layer: 71.5,44.45 76.96,44.45 78.1,43.31 81.28,43.31 81.28,42.01 78.64,42.01 76.58,44.07 71.51,44.07 71.5,44.08
$1N8198 on Top Layer: 71.63,38.74 74.17,38.74 75.84,37.06 81.19,37.06 81.19,35.69 79.88,35.69 78.99,36.58 75.69,36.58 73.91,38.35 71.62,38.35 71.62,38.72

Small or netless copper shapes (teardrops, artwork), in the pictures only: 3 on Top Layer, 2 on Bottom Layer

## Text on the board
Top Silkscreen Layer: +24V | GND | M2_R | M2_L | M3_R | M3_L | M1_R | M1_L
